# EasyEDA schematic Schematic (EasyEDA).json
TITLE: LabbyPSU; REV: 1.0; Date: 2024-07-11; Sheet: 1/1; Drawn By: matebuteler; Company: License: GNU GPL v3.0
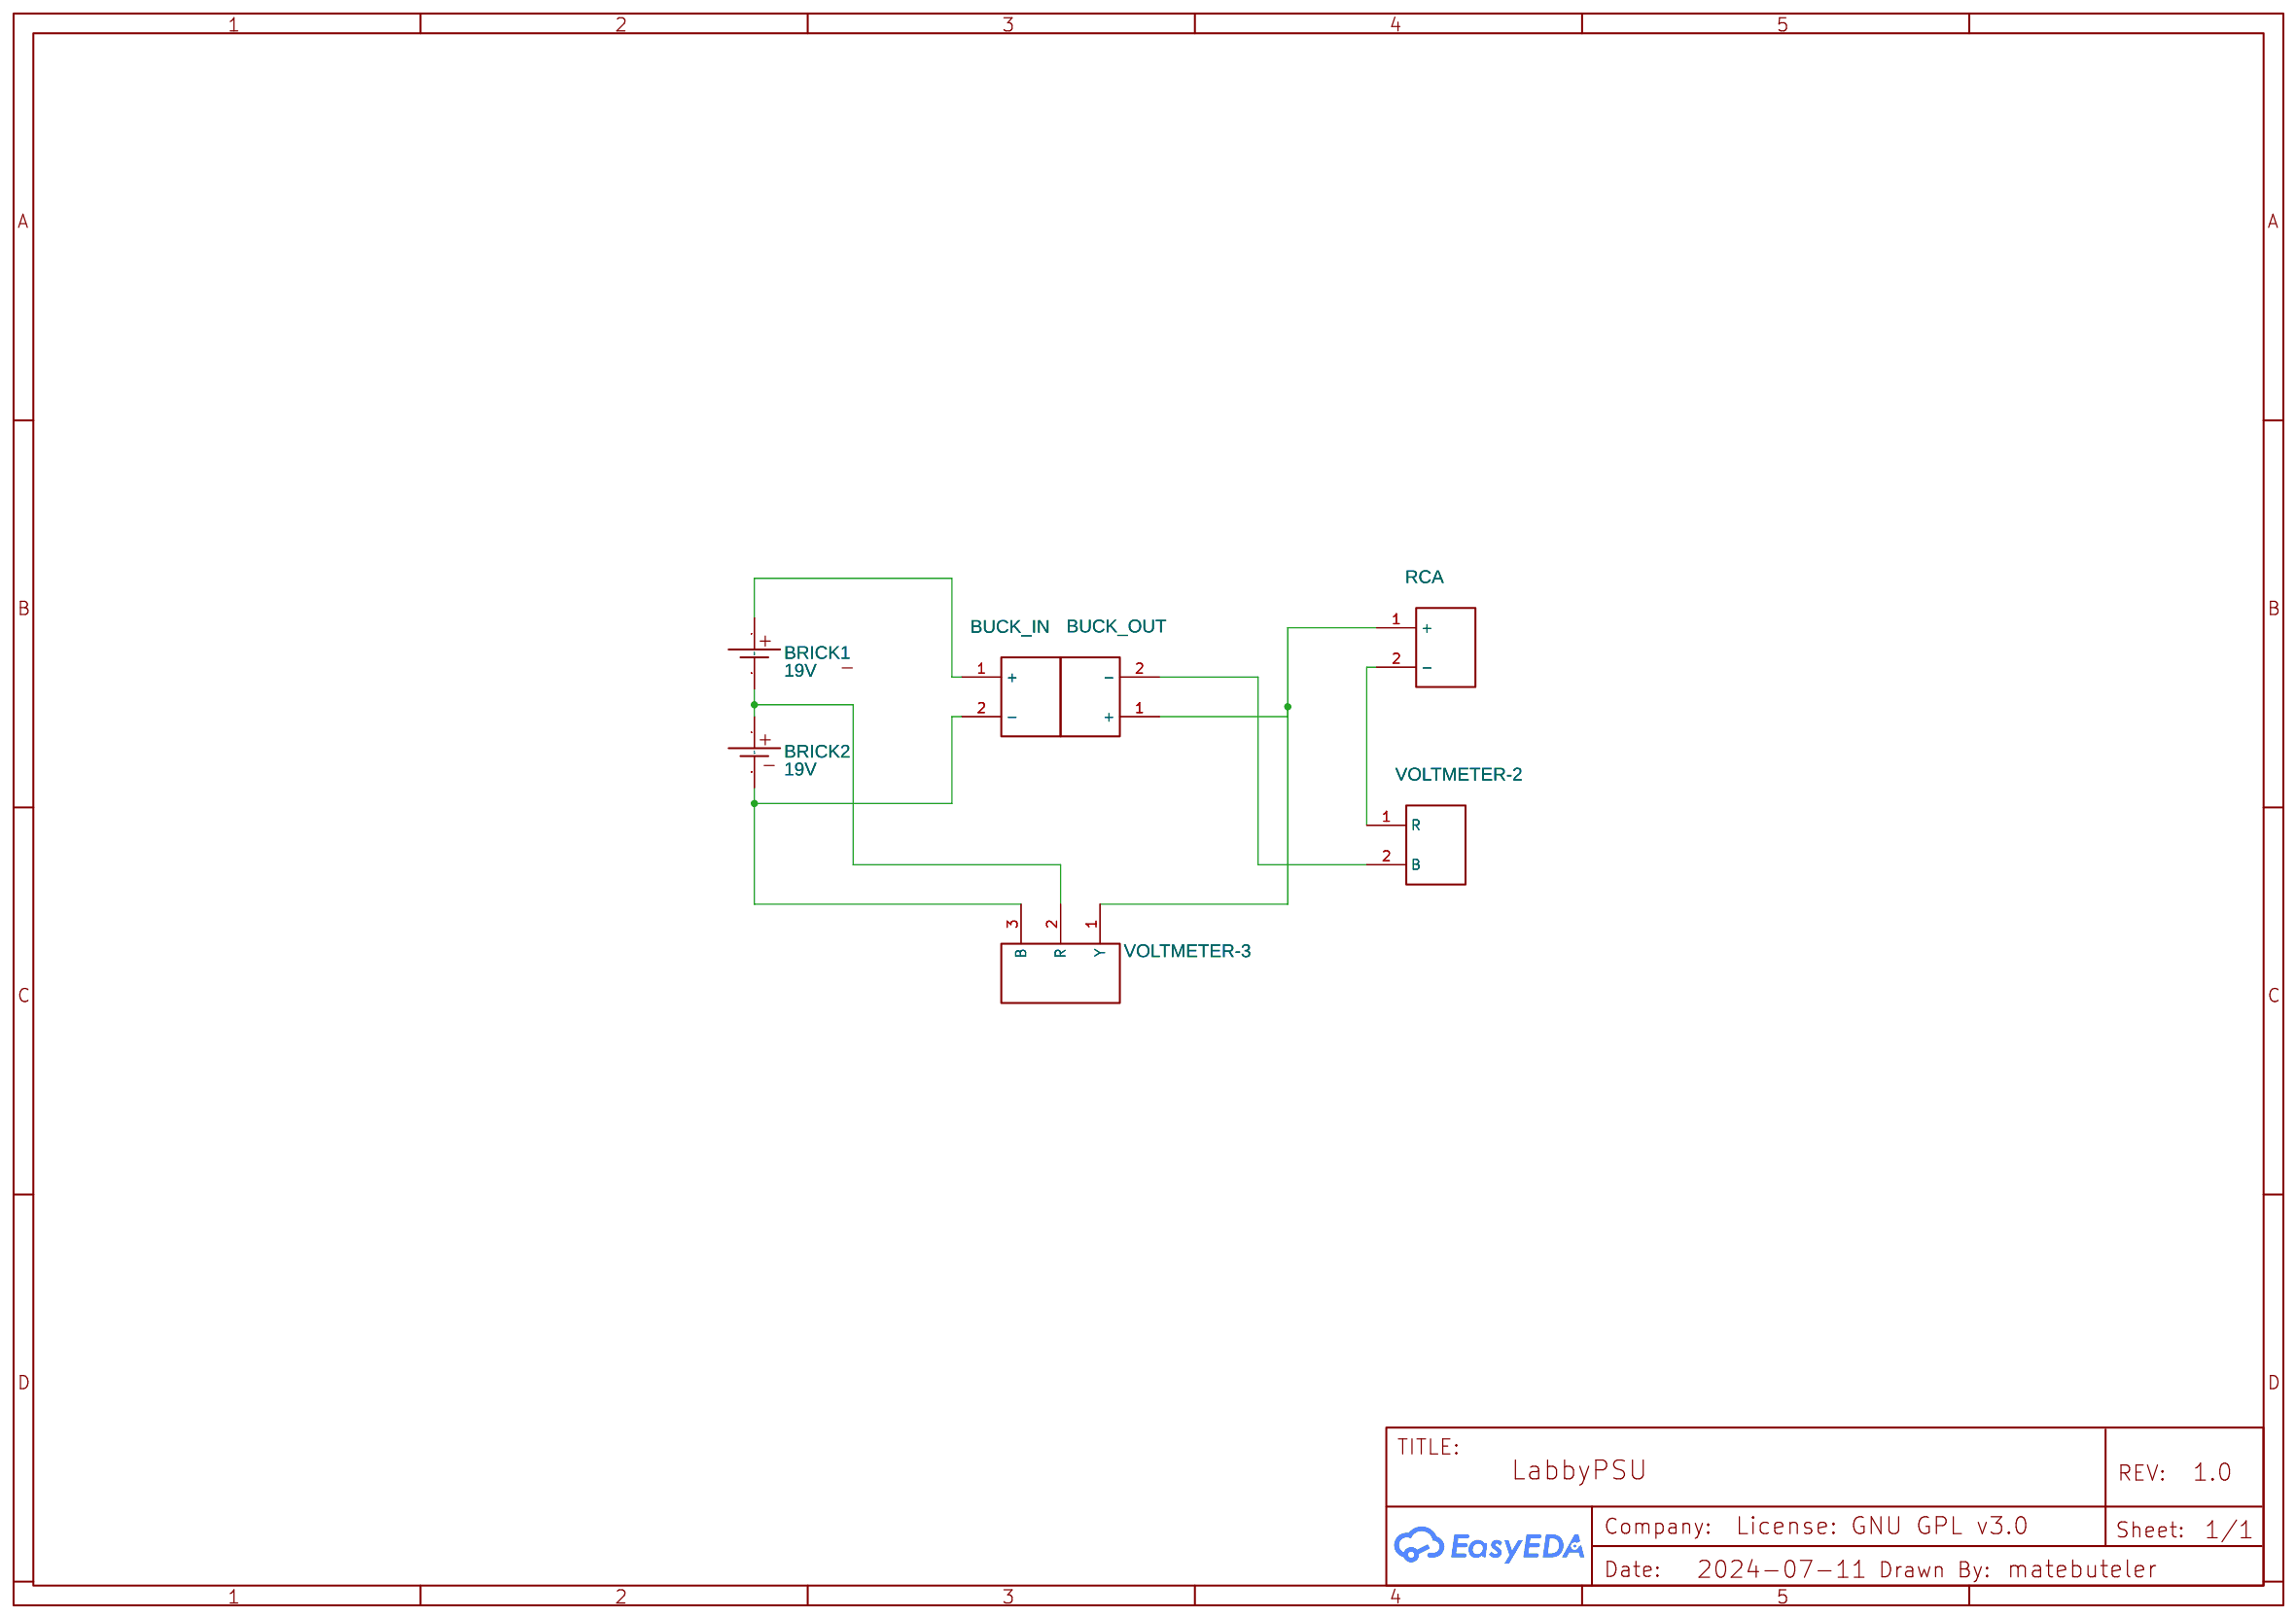
[diagram p0: schematic sheet]

## Parts
BRICK1  19V  [MKDSN1.5/2-5.08]
BRICK2  19V  [MKDSN1.5/2-5.08]
BUCK_IN  MKDSN1.5/2-5.08  [CONN-TH_2P-P5.08]
BUCK_OUT  MKDSN1.5/2-5.08  [CONN-TH_2P-P5.08]
RCA  MKDSN1.5/2-5.08  [CONN-TH_2P-P5.08]
VOLTMETER-2  MKDSN1.5/2-5.08  [CONN-TH_2P-P5.08]
VOLTMETER-3  MKDSN1.5/3-5.08  [CONN-TH_3P-P5.08_1729131]

## Library data of the parts
BRICK1 BRICK2 = SOURCE DC: Contributor: adrejia
BUCK_IN BUCK_OUT RCA VOLTMETER-2 = MKDSN1.5/2-5.08: Supplier: LCSC; Manufacturer: Phoenix Contact(菲尼克斯); Manufacturer Part: 1729128; Supplier Part: C91153; JLCPCB Part Class: Extended Part
VOLTMETER-3 = MKDSN1.5/3-5.08: Supplier: LCSC; Manufacturer: Phoenix Contact(菲尼克斯); Manufacturer Part: 1729131; Supplier Part: C91154

## Nets
Net-(BRICK1-1): BRICK1.1(+) BUCK_IN.1(+)
Net-(BRICK1-2): BRICK1.2(-) BRICK2.1(+) VOLTMETER-3.2(R)
Net-(BRICK2-2): BRICK2.2(-) BUCK_IN.2(-) VOLTMETER-3.3(B)
Net-(BUCK_OUT-1): BUCK_OUT.1(+) RCA.1(+) VOLTMETER-3.1(Y)
Net-(BUCK_OUT-2): BUCK_OUT.2(-) VOLTMETER-2.2(B)
Net-(RCA-2): RCA.2(-) VOLTMETER-2.1(R)
